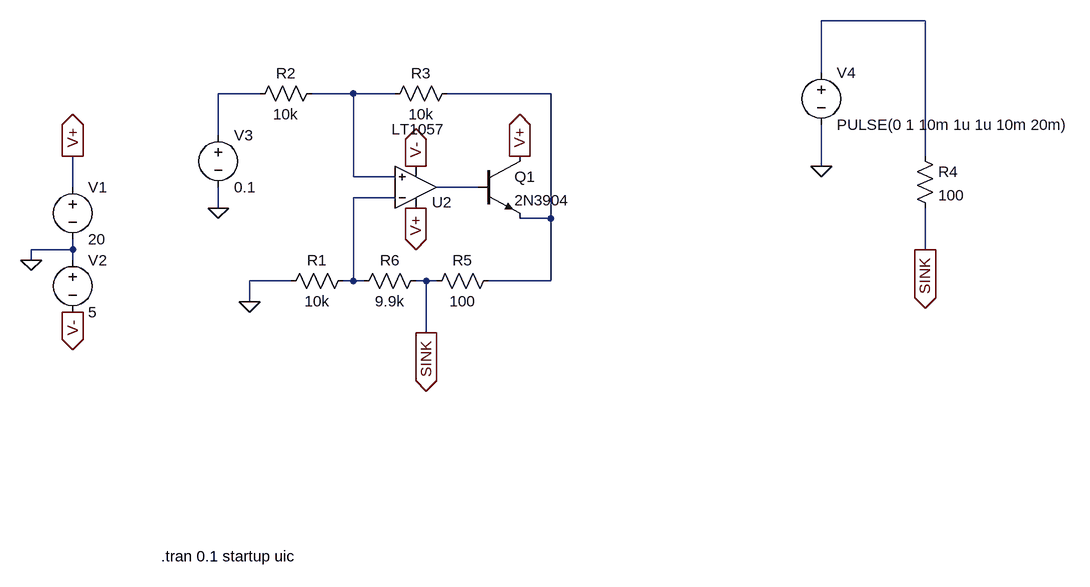
[diagram p0: schematic current_sink_negative_rail.asc]
current_sink_negative_rail.asc, the LTspice schematic file:
Version 4
SHEET 1 1380 680
WIRE 1104 -432 944 -432
WIRE 944 -352 944 -432
WIRE 80 -320 16 -320
WIRE 224 -320 160 -320
WIRE 288 -320 224 -320
WIRE 528 -320 368 -320
WIRE 16 -256 16 -320
WIRE 1104 -224 1104 -432
WIRE 944 -208 944 -272
WIRE 224 -192 224 -320
WIRE 288 -192 224 -192
WIRE -208 -176 -208 -224
WIRE 416 -176 352 -176
WIRE 288 -160 224 -160
WIRE 16 -144 16 -176
WIRE 528 -128 528 -320
WIRE 528 -128 480 -128
WIRE -208 -80 -208 -96
WIRE -208 -80 -272 -80
WIRE 1104 -80 1104 -144
WIRE -272 -64 -272 -80
WIRE -208 -64 -208 -80
WIRE 128 -32 64 -32
WIRE 224 -32 224 -160
WIRE 224 -32 208 -32
WIRE 240 -32 224 -32
WIRE 336 -32 320 -32
WIRE 352 -32 336 -32
WIRE 528 -32 528 -128
WIRE 528 -32 432 -32
WIRE 64 0 64 -32
WIRE 336 48 336 -32
FLAG -272 -64 0
FLAG -208 -224 V+
IOPIN -208 -224 Out
FLAG 320 -144 V+
IOPIN 320 -144 Out
FLAG -208 16 V-
IOPIN -208 16 Out
FLAG 320 -208 V-
IOPIN 320 -208 Out
FLAG 16 -144 0
FLAG 1104 -80 SINK
IOPIN 1104 -80 Out
FLAG 336 48 SINK
IOPIN 336 48 Out
FLAG 64 0 0
FLAG 944 -208 0
FLAG 480 -224 V+
IOPIN 480 -224 Out
SYMBOL voltage -208 -192 R0
WINDOW 123 0 0 Left 2
WINDOW 39 0 0 Left 2
SYMATTR InstName V1
SYMATTR Value 20
SYMBOL voltage -208 -80 R0
WINDOW 123 0 0 Left 2
WINDOW 39 0 0 Left 2
SYMATTR InstName V2
SYMATTR Value 5
SYMBOL voltage 16 -272 R0
WINDOW 123 0 0 Left 2
WINDOW 39 0 0 Left 2
SYMATTR InstName V3
SYMATTR Value 0.1
SYMBOL Opamps\\LT1057 320 -112 M180
WINDOW 3 -37 153 Left 2
WINDOW 0 25 41 Left 2
SYMATTR InstName U2
SYMBOL res 176 -336 R90
WINDOW 0 0 56 VBottom 2
WINDOW 3 32 56 VTop 2
SYMATTR InstName R2
SYMATTR Value 10k
SYMBOL res 384 -336 R90
WINDOW 0 0 56 VBottom 2
WINDOW 3 32 56 VTop 2
SYMATTR InstName R3
SYMATTR Value 10k
SYMBOL res 1088 -240 R0
SYMATTR InstName R4
SYMATTR Value 100
SYMBOL res 224 -48 R90
WINDOW 0 0 56 VBottom 2
WINDOW 3 32 56 VTop 2
SYMATTR InstName R1
SYMATTR Value 10k
SYMBOL res 448 -48 R90
WINDOW 0 0 56 VBottom 2
WINDOW 3 32 56 VTop 2
SYMATTR InstName R5
SYMATTR Value 100
SYMBOL res 336 -48 R90
WINDOW 0 0 56 VBottom 2
WINDOW 3 32 56 VTop 2
SYMATTR InstName R6
SYMATTR Value 9.9k
SYMBOL voltage 944 -368 R0
WINDOW 123 0 0 Left 2
WINDOW 39 0 0 Left 2
SYMATTR InstName V4
SYMATTR Value PULSE(0 1 10m 1u 1u 10m 20m)
SYMBOL npn 416 -224 R0
SYMATTR InstName Q1
SYMATTR Value 2N3904
TEXT -72 392 Left 2 !.tran 0.1 startup uic

The netlist it stands for:
* current_sink_negative_rail.asc
V1 V+ 0 20
V2 0 V- 5
V3 N002 0 0.1
XU2 N003 N006 V+ V- N005 LT1057  ; pins In+ In- V+ V- OUT
R2 N003 N002 10k
R3 N004 N003 10k
R4 N001 SINK 100
R1 N006 0 10k
R5 N004 SINK 100
R6 SINK N006 9.9k
V4 N001 0 PULSE(0 1 10m 1u 1u 10m 20m)
Q1 V+ N005 N004 0 2N3904
.model NPN NPN
.model PNP PNP
.lib standard.bjt
.tran 0.1 startup uic
.lib LTC.lib
.backanno
.end